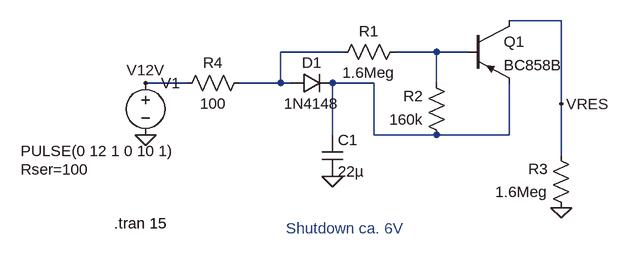
[diagram p0: schematic shutdown.asc]
shutdown.asc, the LTspice schematic file:
Version 4
SHEET 1 880 680
WIRE 480 16 400 16
WIRE 144 64 48 64
WIRE 288 64 224 64
WIRE 336 64 288 64
WIRE -96 112 -160 112
WIRE 48 112 48 64
WIRE 48 112 -16 112
WIRE 64 112 48 112
WIRE 192 112 128 112
WIRE 288 112 288 64
WIRE 480 144 480 16
WIRE 128 192 128 112
WIRE 192 192 192 112
WIRE 288 192 192 192
WIRE 400 192 400 112
WIRE 400 192 288 192
WIRE 480 224 480 144
FLAG -160 192 0
FLAG 128 256 0
FLAG 480 304 0
FLAG 480 144 VRES
FLAG -160 112 V12V
SYMBOL voltage -160 96 R0
WINDOW 3 -192 121 Left 2
WINDOW 123 0 0 Left 0
WINDOW 39 -192 149 Left 2
SYMATTR Value PULSE(0 12 1 0 10 1)
SYMATTR SpiceLine Rser=100
SYMATTR InstName V1
SYMBOL res 240 48 R90
WINDOW 0 0 56 VBottom 2
WINDOW 3 32 56 VTop 2
SYMATTR InstName R1
SYMATTR Value 1.6Meg
SYMBOL res 304 208 R180
WINDOW 0 36 76 Left 2
WINDOW 3 36 40 Left 2
SYMATTR InstName R2
SYMATTR Value 160k
SYMBOL res 496 320 R180
WINDOW 0 36 76 Left 2
WINDOW 3 36 40 Left 2
SYMATTR InstName R3
SYMATTR Value 1.6Meg
SYMBOL diode 64 128 R270
WINDOW 0 32 32 VTop 2
WINDOW 3 0 32 VBottom 2
SYMATTR InstName D1
SYMATTR Value 1N4148
SYMBOL cap 112 192 R0
SYMATTR InstName C1
SYMATTR Value 22µ
SYMBOL pnp 336 16 R0
SYMATTR InstName Q1
SYMATTR Value BC858B
SYMBOL res 0 96 R90
WINDOW 0 0 56 VBottom 2
WINDOW 3 32 56 VTop 2
SYMATTR InstName R4
SYMATTR Value 100
TEXT -208 328 Left 2 !.tran 15
TEXT 56 336 Left 2 ;Shutdown ca. 6V

The netlist it stands for:
* shutdown.asc
V1 V12V 0 PULSE(0 12 1 0 10 1) Rser=100
R1 N002 N001 1.6Meg
R2 N003 N002 160k
R3 0 VRES 1.6Meg
D1 N001 N003 1N4148
C1 N003 0 22µ
Q1 VRES N002 N003 0 BC858B
R4 N001 V12V 100
.model D D
.lib standard.dio
.model NPN NPN
.model PNP PNP
.lib standard.bjt
.tran 15
* Shutdown ca. 6V
.backanno
.end